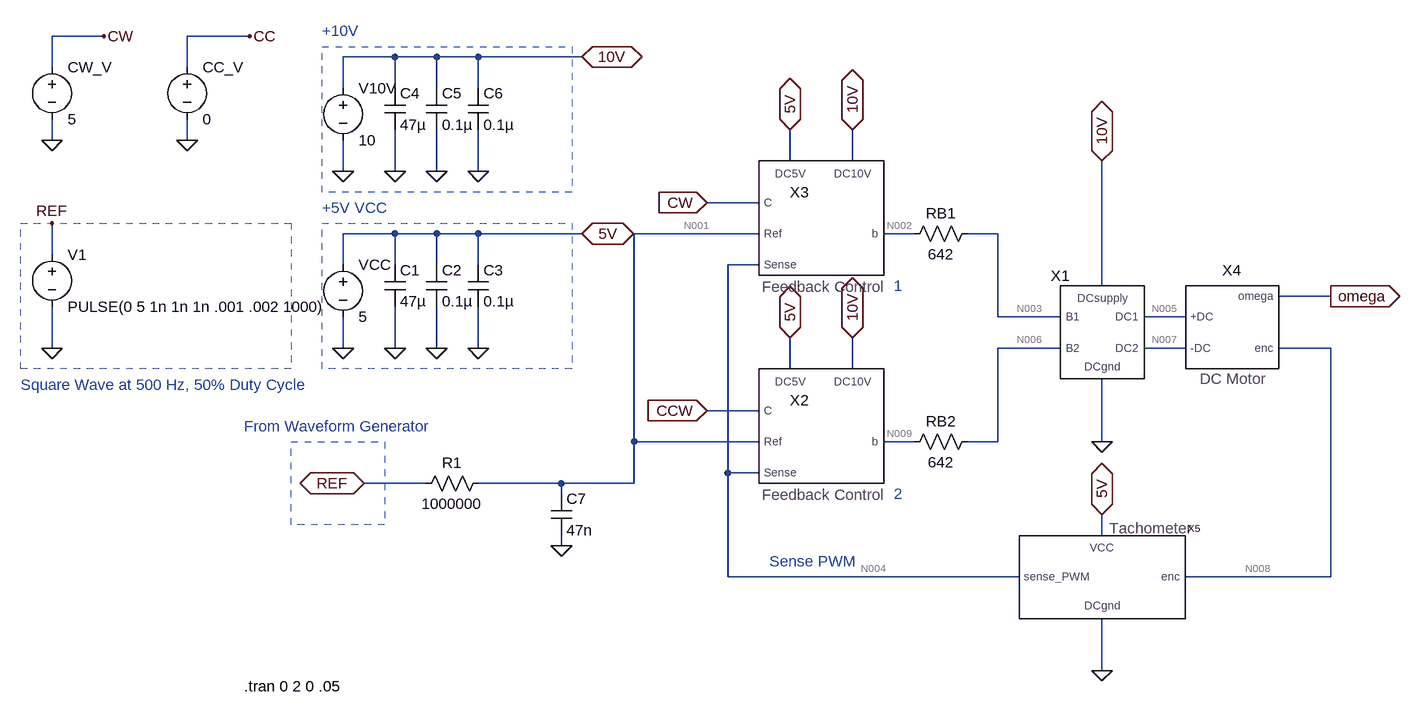
[diagram p0: schematic Speed_Control_Demo.asc]
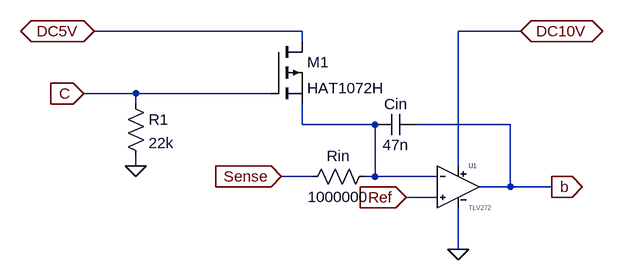
[diagram p1: sub-circuit feedback_control.asc]
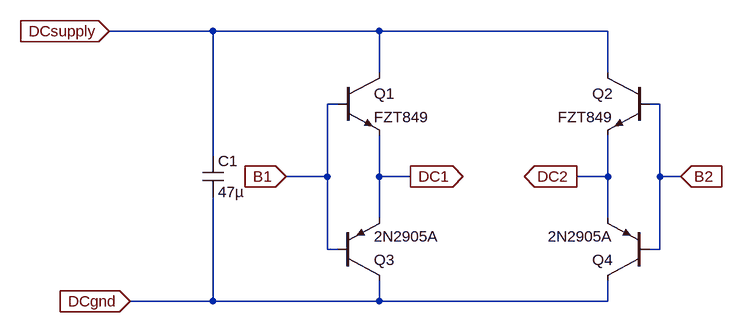
[diagram p2: sub-circuit dc_motor_driver.asc]
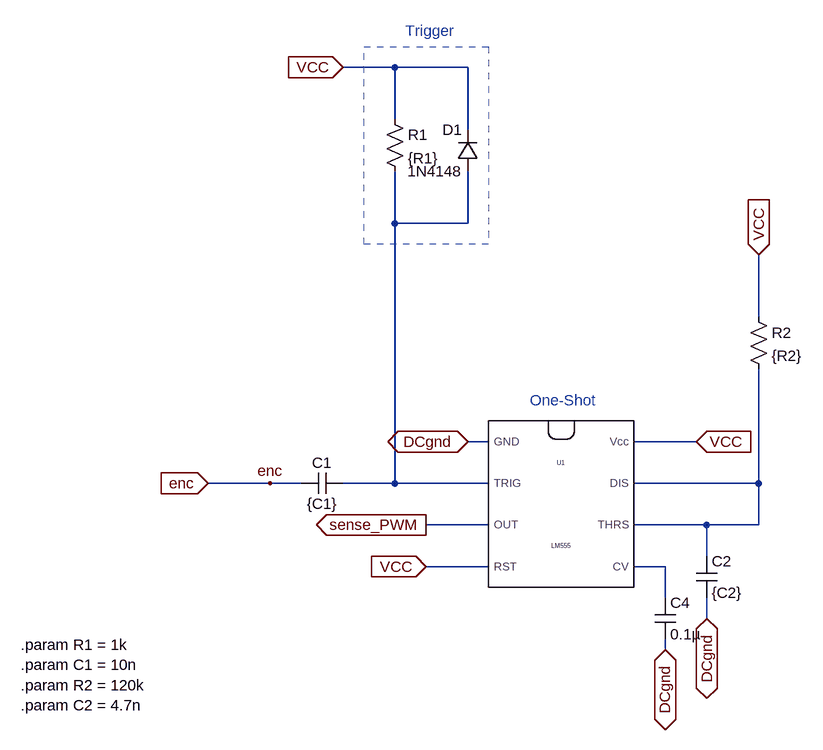
[diagram p3: sub-circuit tach.asc]
Speed_Control_Demo.asc, the LTspice schematic file:
Version 4
SHEET 1 1492 1016
WIRE -544 0 -624 0
WIRE -320 0 -416 0
WIRE -96 32 -176 32
WIRE -32 32 -96 32
WIRE 32 32 -32 32
WIRE 192 32 32 32
WIRE -624 48 -624 0
WIRE -416 48 -416 0
WIRE -176 80 -176 32
WIRE -96 80 -96 32
WIRE -32 80 -32 32
WIRE 32 80 32 32
WIRE -624 160 -624 128
WIRE -416 160 -416 128
WIRE 512 192 512 144
WIRE 608 192 608 144
WIRE -176 208 -176 160
WIRE -96 208 -96 144
WIRE -32 208 -32 144
WIRE 32 208 32 144
WIRE 464 256 384 256
WIRE -96 304 -176 304
WIRE -32 304 -96 304
WIRE 32 304 -32 304
WIRE 192 304 32 304
WIRE 464 304 272 304
WIRE 704 304 656 304
WIRE 832 304 784 304
WIRE -624 336 -624 288
WIRE -176 352 -176 304
WIRE -96 352 -96 304
WIRE -32 352 -32 304
WIRE 32 352 32 304
WIRE 464 352 416 352
WIRE 992 384 992 192
WIRE 1344 400 1264 400
WIRE 832 432 832 304
WIRE 928 432 832 432
WIRE 1120 432 1056 432
WIRE -624 480 -624 416
WIRE -176 480 -176 432
WIRE -96 480 -96 416
WIRE -32 480 -32 416
WIRE 32 480 32 416
WIRE 928 480 832 480
WIRE 1120 480 1056 480
WIRE 1344 480 1264 480
WIRE 512 512 512 464
WIRE 608 512 608 464
WIRE 464 576 384 576
WIRE 272 624 272 304
WIRE 464 624 272 624
WIRE 704 624 656 624
WIRE 832 624 832 480
WIRE 832 624 784 624
WIRE 992 624 992 528
WIRE 416 672 416 352
WIRE 464 672 416 672
WIRE -48 688 -144 688
WIRE 160 688 32 688
WIRE 272 688 272 624
WIRE 272 688 160 688
WIRE 160 704 160 688
WIRE 992 768 992 736
WIRE 160 784 160 768
WIRE 416 832 416 672
WIRE 864 832 416 832
WIRE 1344 832 1344 480
WIRE 1344 832 1120 832
WIRE 992 976 992 896
FLAG -176 480 0
FLAG 384 256 CW
IOPIN 384 256 In
FLAG 384 576 CCW
IOPIN 384 576 In
FLAG 192 304 5V
IOPIN 192 304 BiDir
FLAG 512 144 5V
IOPIN 512 144 BiDir
FLAG 512 464 5V
IOPIN 512 464 BiDir
FLAG 32 480 0
FLAG -32 480 0
FLAG -96 480 0
FLAG -176 208 0
FLAG 192 32 10V
IOPIN 192 32 BiDir
FLAG 32 208 0
FLAG -32 208 0
FLAG -96 208 0
FLAG 608 144 10V
IOPIN 608 144 BiDir
FLAG 608 464 10V
IOPIN 608 464 BiDir
FLAG -144 688 REF
IOPIN -144 688 BiDir
FLAG 160 784 0
FLAG 992 192 10V
IOPIN 992 192 BiDir
FLAG 992 624 0
FLAG 1344 400 omega
IOPIN 1344 400 Out
FLAG 992 976 0
FLAG 992 736 5V
IOPIN 992 736 BiDir
FLAG -624 288 REF
FLAG -624 480 0
FLAG -624 160 0
FLAG -544 0 CW
FLAG -416 160 0
FLAG -320 0 CC
SYMBOL voltage -176 336 R0
WINDOW 123 0 0 Left 2
WINDOW 39 0 0 Left 2
SYMATTR InstName VCC
SYMATTR Value 5
SYMBOL feedback_control 512 240 R0
WINDOW 0 0 0 Left 2
SYMATTR InstName X3
SYMBOL feedback_control 512 560 R0
WINDOW 0 0 0 Left 2
SYMATTR InstName X2
SYMBOL cap -112 352 R0
SYMATTR InstName C1
SYMATTR Value 47µ
SYMBOL cap -48 352 R0
SYMATTR InstName C2
SYMATTR Value 0.1µ
SYMBOL cap 16 352 R0
SYMATTR InstName C3
SYMATTR Value 0.1µ
SYMBOL voltage -176 64 R0
WINDOW 123 0 0 Left 2
WINDOW 39 0 0 Left 2
SYMATTR InstName V10V
SYMATTR Value 10
SYMBOL cap -112 80 R0
SYMATTR InstName C4
SYMATTR Value 47µ
SYMBOL cap -48 80 R0
SYMATTR InstName C5
SYMATTR Value 0.1µ
SYMBOL cap 16 80 R0
SYMATTR InstName C6
SYMATTR Value 0.1µ
SYMBOL res 48 672 R90
WINDOW 0 0 56 VBottom 2
WINDOW 3 32 56 VTop 2
SYMATTR InstName R1
SYMATTR Value 1000000
SYMBOL cap 144 704 R0
SYMATTR InstName C7
SYMATTR Value 47n
SYMBOL res 800 288 R90
WINDOW 0 0 56 VBottom 2
WINDOW 3 32 56 VTop 2
SYMATTR InstName RB1
SYMATTR Value 642
SYMBOL res 800 608 R90
WINDOW 0 0 56 VBottom 2
WINDOW 3 32 56 VTop 2
SYMATTR InstName RB2
SYMATTR Value 642
SYMBOL DC_Motor_Driver 992 448 R0
SYMATTR InstName X1
SYMBOL DC_motor_model 1184 448 R0
SYMATTR InstName X4
SYMBOL tach 1008 816 R0
SYMATTR InstName X5
SYMBOL voltage -624 320 R0
WINDOW 123 0 0 Left 2
WINDOW 39 0 0 Left 2
SYMATTR InstName V1
SYMATTR Value PULSE(0 5 1n 1n 1n .001 .002 1000)
SYMBOL voltage -624 32 R0
SYMATTR InstName CW_V
SYMATTR Value 5
SYMBOL voltage -416 32 R0
WINDOW 123 0 0 Left 2
WINDOW 39 0 0 Left 2
SYMATTR InstName CC_V
SYMATTR Value 0
TEXT -208 264 Left 2 ;+5V VCC
TEXT 672 384 Left 2 ;1
TEXT 672 704 Left 2 ;2
TEXT -208 -8 Left 2 ;+10V
TEXT -328 600 Left 2 ;From Waveform Generator
TEXT 480 808 Left 2 ;Sense PWM
TEXT -328 1000 Left 2 !.tran 0 2 0 .05
TEXT -672 536 Left 2 ;Square Wave at 500 Hz, 50% Duty Cycle
RECTANGLE Normal 176 512 -208 288 2
RECTANGLE Normal 176 240 -208 16 2
RECTANGLE Normal -112 752 -256 624 2
RECTANGLE Normal -256 512 -672 288 2

feedback_control.asc, the sub-circuit schematic file:
Version 4
SHEET 1 880 680
WIRE 336 64 16 64
WIRE 672 64 576 64
WIRE 336 80 336 64
WIRE 80 160 0 160
WIRE 288 160 80 160
WIRE 80 176 80 160
WIRE 336 208 336 176
WIRE 448 208 336 208
WIRE 656 208 512 208
WIRE 80 272 80 256
WIRE 576 272 576 64
WIRE 352 288 304 288
WIRE 448 288 448 208
WIRE 448 288 432 288
WIRE 544 288 448 288
WIRE 656 304 656 208
WIRE 656 304 608 304
WIRE 720 304 656 304
WIRE 544 320 496 320
WIRE 576 400 576 336
FLAG 16 64 DC5V
IOPIN 16 64 BiDir
FLAG 0 160 C
IOPIN 0 160 In
FLAG 304 288 Sense
IOPIN 304 288 In
FLAG 496 320 Ref
IOPIN 496 320 In
FLAG 672 64 DC10V
IOPIN 672 64 BiDir
FLAG 720 304 b
IOPIN 720 304 Out
FLAG 80 272 0
FLAG 576 400 0
SYMBOL pmos 288 80 R0
SYMATTR InstName M1
SYMATTR Value HAT1072H
SYMBOL res 64 160 R0
SYMATTR InstName R1
SYMATTR Value 22k
SYMBOL TLV272 576 304 R0
SYMATTR InstName U1
SYMBOL cap 512 192 R90
WINDOW 0 0 32 VBottom 2
WINDOW 3 32 32 VTop 2
SYMATTR InstName Cin
SYMATTR Value 47n
SYMBOL res 448 272 R90
WINDOW 0 0 56 VBottom 2
WINDOW 3 32 56 VTop 2
SYMATTR InstName Rin
SYMATTR Value 1000000

dc_motor_driver.asc, the sub-circuit schematic file:
Version 4
SHEET 1 972 680
WIRE 160 0 0 0
WIRE 416 0 160 0
WIRE 768 0 416 0
WIRE 416 64 416 0
WIRE 768 64 768 0
WIRE 352 112 336 112
WIRE 848 112 832 112
WIRE 160 192 160 0
WIRE 336 224 336 112
WIRE 336 224 272 224
WIRE 416 224 416 160
WIRE 464 224 416 224
WIRE 768 224 768 160
WIRE 768 224 720 224
WIRE 848 224 848 112
WIRE 880 224 848 224
WIRE 416 288 416 224
WIRE 768 288 768 224
WIRE 336 336 336 224
WIRE 352 336 336 336
WIRE 848 336 848 224
WIRE 848 336 832 336
WIRE 160 416 160 256
WIRE 160 416 32 416
WIRE 416 416 416 384
WIRE 416 416 160 416
WIRE 768 416 768 384
WIRE 768 416 416 416
FLAG 0 0 DCsupply
IOPIN 0 0 In
FLAG 32 416 DCgnd
IOPIN 32 416 In
FLAG 272 224 B1
IOPIN 272 224 In
FLAG 464 224 DC1
IOPIN 464 224 Out
FLAG 720 224 DC2
IOPIN 720 224 Out
FLAG 880 224 B2
IOPIN 880 224 In
SYMBOL pnp 832 384 R180
SYMATTR InstName Q4
SYMATTR Value 2N2905A
SYMBOL pnp 352 384 M180
SYMATTR InstName Q3
SYMATTR Value 2N2905A
SYMBOL npn 352 64 R0
SYMATTR InstName Q1
SYMATTR Value FZT849
SYMBOL npn 832 64 M0
SYMATTR InstName Q2
SYMATTR Value FZT849
SYMBOL cap 144 192 R0
SYMATTR InstName C1
SYMATTR Value 47µ

tach.asc, the sub-circuit schematic file:
Version 4
SHEET 1 1188 692
WIRE 512 -480 432 -480
WIRE 624 -480 512 -480
WIRE 512 -400 512 -480
WIRE 624 -384 624 -480
WIRE 512 -240 512 -320
WIRE 624 -240 624 -320
WIRE 624 -240 512 -240
WIRE 1072 -96 1072 -192
WIRE 656 96 624 96
WIRE 976 96 880 96
WIRE 320 160 224 160
WIRE 368 160 320 160
WIRE 512 160 512 -240
WIRE 512 160 432 160
WIRE 656 160 512 160
WIRE 1072 160 1072 -16
WIRE 1072 160 880 160
WIRE 656 224 560 224
WIRE 992 224 880 224
WIRE 1072 224 1072 160
WIRE 1072 224 992 224
WIRE 992 272 992 224
WIRE 656 288 560 288
WIRE 928 288 880 288
WIRE 928 336 928 288
WIRE 992 368 992 336
WIRE 928 416 928 400
FLAG 320 160 enc
FLAG 560 288 VCC
IOPIN 560 288 In
FLAG 560 224 sense_PWM
IOPIN 560 224 Out
FLAG 976 96 VCC
IOPIN 976 96 In
FLAG 432 -480 VCC
IOPIN 432 -480 In
FLAG 1072 -192 VCC
IOPIN 1072 -192 In
FLAG 224 160 enc
IOPIN 224 160 In
FLAG 992 368 DCgnd
IOPIN 992 368 BiDir
FLAG 928 416 DCgnd
IOPIN 928 416 BiDir
FLAG 624 96 DCgnd
IOPIN 624 96 BiDir
SYMBOL cap 432 144 R90
WINDOW 0 0 32 VBottom 2
WINDOW 3 32 32 VTop 2
SYMATTR InstName C1
SYMATTR Value {C1}
SYMBOL res 496 -416 R0
SYMATTR InstName R1
SYMATTR Value {R1}
SYMBOL diode 640 -320 R180
WINDOW 0 24 64 Left 2
WINDOW 3 24 0 Left 2
SYMATTR InstName D1
SYMATTR Value 1N4148
SYMBOL LM555 768 192 R0
SYMATTR InstName U1
SYMBOL cap 912 336 R0
SYMATTR InstName C4
SYMATTR Value 0.1µ
SYMBOL cap 976 272 R0
SYMATTR InstName C2
SYMATTR Value {C2}
SYMBOL res 1056 -112 R0
SYMATTR InstName R2
SYMATTR Value {R2}
TEXT 528 -536 Left 2 ;Trigger
TEXT 720 32 Left 2 ;One-Shot
TEXT -64 408 Left 2 !.param R1 = 1k\n.param C1 = 10n\n.param R2 = 120k\n.param C2 = 4.7n
RECTANGLE Normal 656 -208 464 -512 2

The netlist it stands for:
* Speed_Control_Demo.asc
VCC 5V 0 5
XX3 CW N001 N004 5V 10V N002 feedback_control
XX2 CCW N001 N004 5V 10V N009 feedback_control
C1 5V 0 47µ
C2 5V 0 0.1µ
C3 5V 0 0.1µ
V10V 10V 0 10
C4 10V 0 47µ
C5 10V 0 0.1µ
C6 10V 0 0.1µ
R1 N001 REF 1000000
C7 N001 0 47n
RB1 N003 N002 642
RB2 N006 N009 642
XX1 N003 N006 N005 N007 10V 0 dc_motor_driver
XX4 N005 N007 N008 omega DC_motor_model  ; pins +DC -DC enc omega
XX5 N008 5V 0 N004 tach
V1 REF 0 PULSE(0 5 1n 1n 1n .001 .002 1000)
V§CW_V CW 0 5
V§CC_V CC 0 0

* block symbol definitions
.subckt feedback_control C Ref Sense DC5V DC10V b
M1 DC5V C N001 N001 HAT1072H
R1 C 0 22k
XU1 Ref N001 DC10V 0 b level.2 Avol=1Meg GBW=3Meg Slew=2.4Meg ilimit=20m rail=0.1 Vos=0 phimargin=45 en=0 enk=0 in=0 ink=0 Rin=500Meg  ; pins In+ In- V+ V- OUT
Cin b N001 47n
Rin N001 Sense 1000000
.ends feedback_control

.subckt dc_motor_driver B1 B2 DC1 DC2 DCsupply DCgnd
Q4 DCgnd B2 DC2 0 2N2905A
Q3 DCgnd B1 DC1 0 2N2905A
Q1 DCsupply B1 DC1 0 FZT849
Q2 DCsupply B2 DC2 0 FZT849
C1 DCsupply DCgnd 47µ
.ends dc_motor_driver

.subckt tach enc VCC DCgnd sense_PWM
C1 N001 enc {C1}
R1 VCC N001 {R1}
D1 N001 VCC 1N4148
XU1 DCgnd N001 sense_PWM VCC N003 N002 N002 VCC NE555  ; pins GND TRIG OUT RST CV THRS DIS Vcc
C4 N003 DCgnd 0.1µ
C2 N002 DCgnd {C2}
R2 VCC N002 {R2}
* Trigger
* One-Shot
.param R1 = 1k
.param C1 = 10n
.param R2 = 120k
.param C2 = 4.7n
.ends tach

.model D D
.lib standard.dio
.model NPN NPN
.model PNP PNP
.lib standard.bjt
.model NMOS NMOS
.model PMOS PMOS
.lib standard.mos
* +5V VCC
* 1
* 2
* +10V
* From Waveform Generator
* Sense PWM
.tran 0 2 0 .05
* Square Wave at 500 Hz, 50% Duty Cycle
.lib UniversalOpamps2.sub
.lib NE555.sub
.backanno
.end

* Results of the author's LTspice run, read from the files saved beside the schematic
* Operating Point, zero values left out:
*   V(5v) = 5 V
*   V(cw) = 5 V
*   V(n002) = 100.5 mV
*   V(10v) = 10 V
*   V(n001) = 19.9 mV
*   V(n004) = 88.5 µV
*   V(n009) = 100.5 mV
*   V(n003) = 100.5 mV
*   V(n006) = 100.5 mV
*   V(n007) = 100.8 mV
*   V(n005) = 100.8 mV
*   V(n008) = 5 V
*   I(C7) = 24.45 pA
*   I(Rb2) = 99.16 pA
*   I(Rb1) = 99.16 pA
*   I(R1) = 19.9 nA
*   I(Cw_v) = -227.3 µA
*   I(V1) = 19.9 nA
*   I(V10v) = -2.316 µA
*   I(Vcc) = -1.662 mA
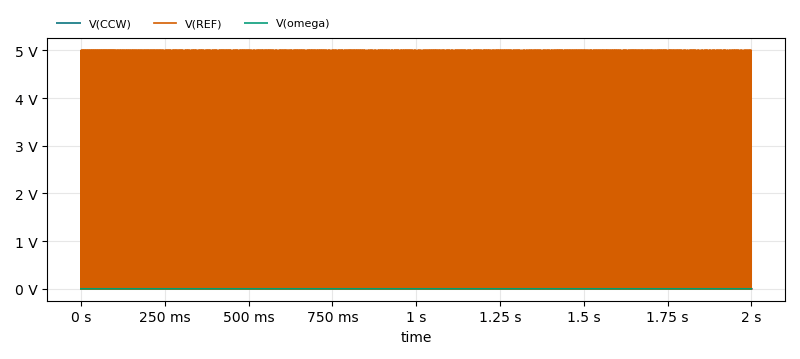
[diagram p4: Transient Analysis of Speed_Control_Demo.asc, plotted from the saved traces]
* Transient Analysis, 1 run:
*   V(CCW): min -15.2 nV, max 15.21 nV, average -394.2 fV, rms 201.3 pV, last 0 V
*   V(REF): min 0 V, max 5 V, average 2.521 V, rms 3.55 V, last 0 V
*   V(omega): min -3.292 nV, max 125.9 pV, average 47.01 fV, rms 60.93 pV, last 0.4276 fV